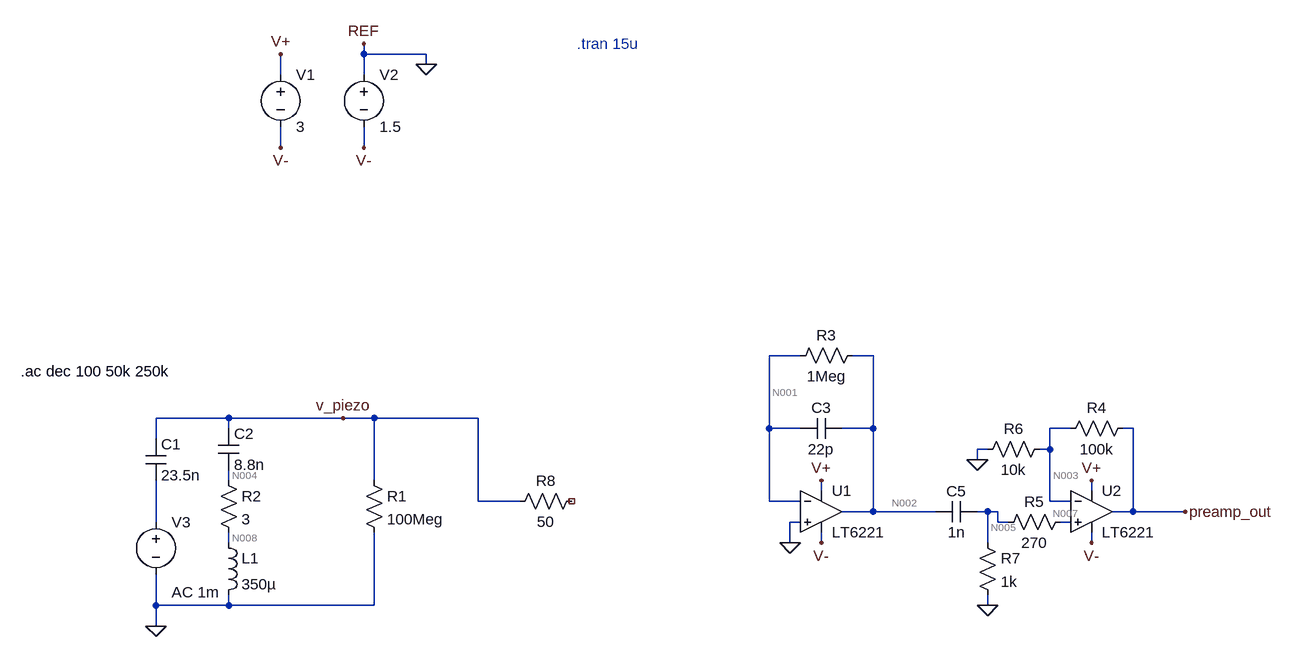
[diagram p0: schematic sensor_preamp.asc]
* sensor_preamp.asc
C1 v_piezo N006 23.5n
R1 v_piezo 0 100Meg
R2 N004 N008 3
C2 v_piezo N004 8.8n
L1 N008 0 350µ Rser=1m
* U1: LT6221 (symbol Opamps\LT6221 not available, pins judged from their places): In+=0 In-=N001 V+=V+ V-=V- OUT=N002
C3 N002 N001 22p
R3 N002 N001 1Meg
* U2: LT6221 (symbol Opamps\LT6221 not available, pins judged from their places): In+=N007 In-=N003 V+=V+ V-=V- OUT=preamp_out
R4 preamp_out N003 100k
R5 N007 N005 270
R6 N003 0 10k
C5 N005 N002 1n
R7 N005 0 1k
R8 NC_01 v_piezo 50
V1 V+ V- 3
V2 0 V- 1.5
V3 N006 0 AC 1m
.ac dec 100 50k 250k
* .tran 15u
.backanno
.end

* Results of the author's LTspice run, read from the files saved beside the schematic
* Operating Point, zero values left out:
*   V(n001) = -130.3 nV
*   V(n002) = -10.48 mV
*   V(n003) = 13.17 µV
*   V(n005) = 10.48 µV
*   V(n007) = 13.3 µV
*   V(preamp_out) = -902.7 µV
*   V(v+) = 1.5 V
*   V(v-) = -1.5 V
*   I(R3) = -10.48 nA
*   I(R4) = -9.159 nA
*   I(R5) = 10.48 nA
*   I(R6) = 1.317 nA
*   I(R7) = 10.48 nA
*   I(V1) = -1.615 mA
*   I(V2) = 22.27 nA
*   Ix(u1:1) = -10.48 nA
*   Ix(u1:2) = -10.48 nA
*   Ix(u1:3) = 807.7 µA
*   Ix(u1:4) = -807.7 µA
*   Ix(u1:5) = 10.48 nA
*   Ix(u2:1) = -10.48 nA
*   Ix(u2:2) = -10.48 nA
*   Ix(u2:3) = 807.7 µA
*   Ix(u2:4) = -807.7 µA
*   Ix(u2:5) = 9.159 nA
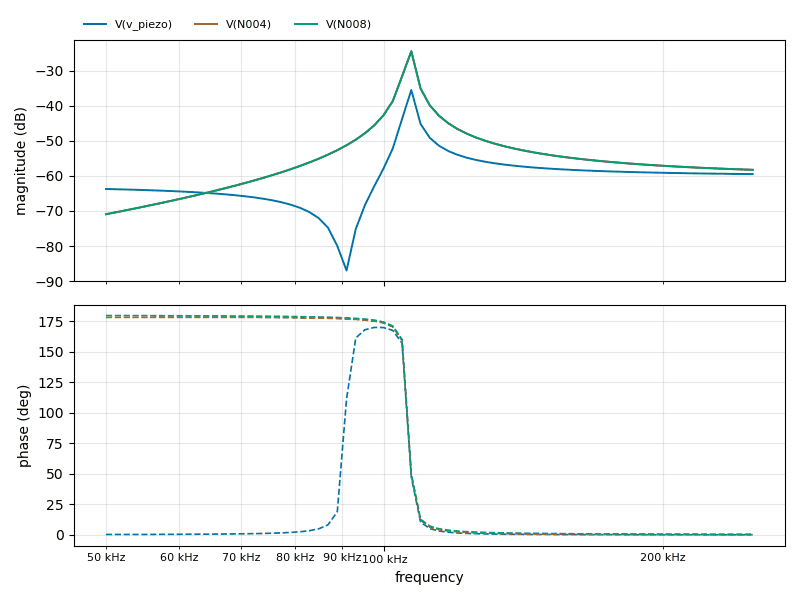
[diagram p1: AC Analysis of sensor_preamp.asc, plotted from the saved traces]
* AC Analysis, 1 run:
*   V(v_piezo): -63.74 dB at 50 kHz, -59.49 dB at 250 kHz, peak -35.50 dB at 106.9 kHz, 3 dB below the peak at 106 kHz and 107.7 kHz
*   V(N004): -70.93 dB at 50 kHz, -58.27 dB at 250 kHz, peak -24.46 dB at 106.9 kHz, 3 dB below the peak at 105.9 kHz and 107.6 kHz
*   V(N008): -70.93 dB at 50 kHz, -58.27 dB at 250 kHz, peak -24.47 dB at 106.9 kHz, 3 dB below the peak at 105.9 kHz and 107.6 kHz